# Altium project DUTBoard.PrjPcb (part 3 of 5)

## Sheet ZIF_WRP.SchDoc
size B; DocumentNumber: 9; SheetNumber: 9; SheetTotal: 13
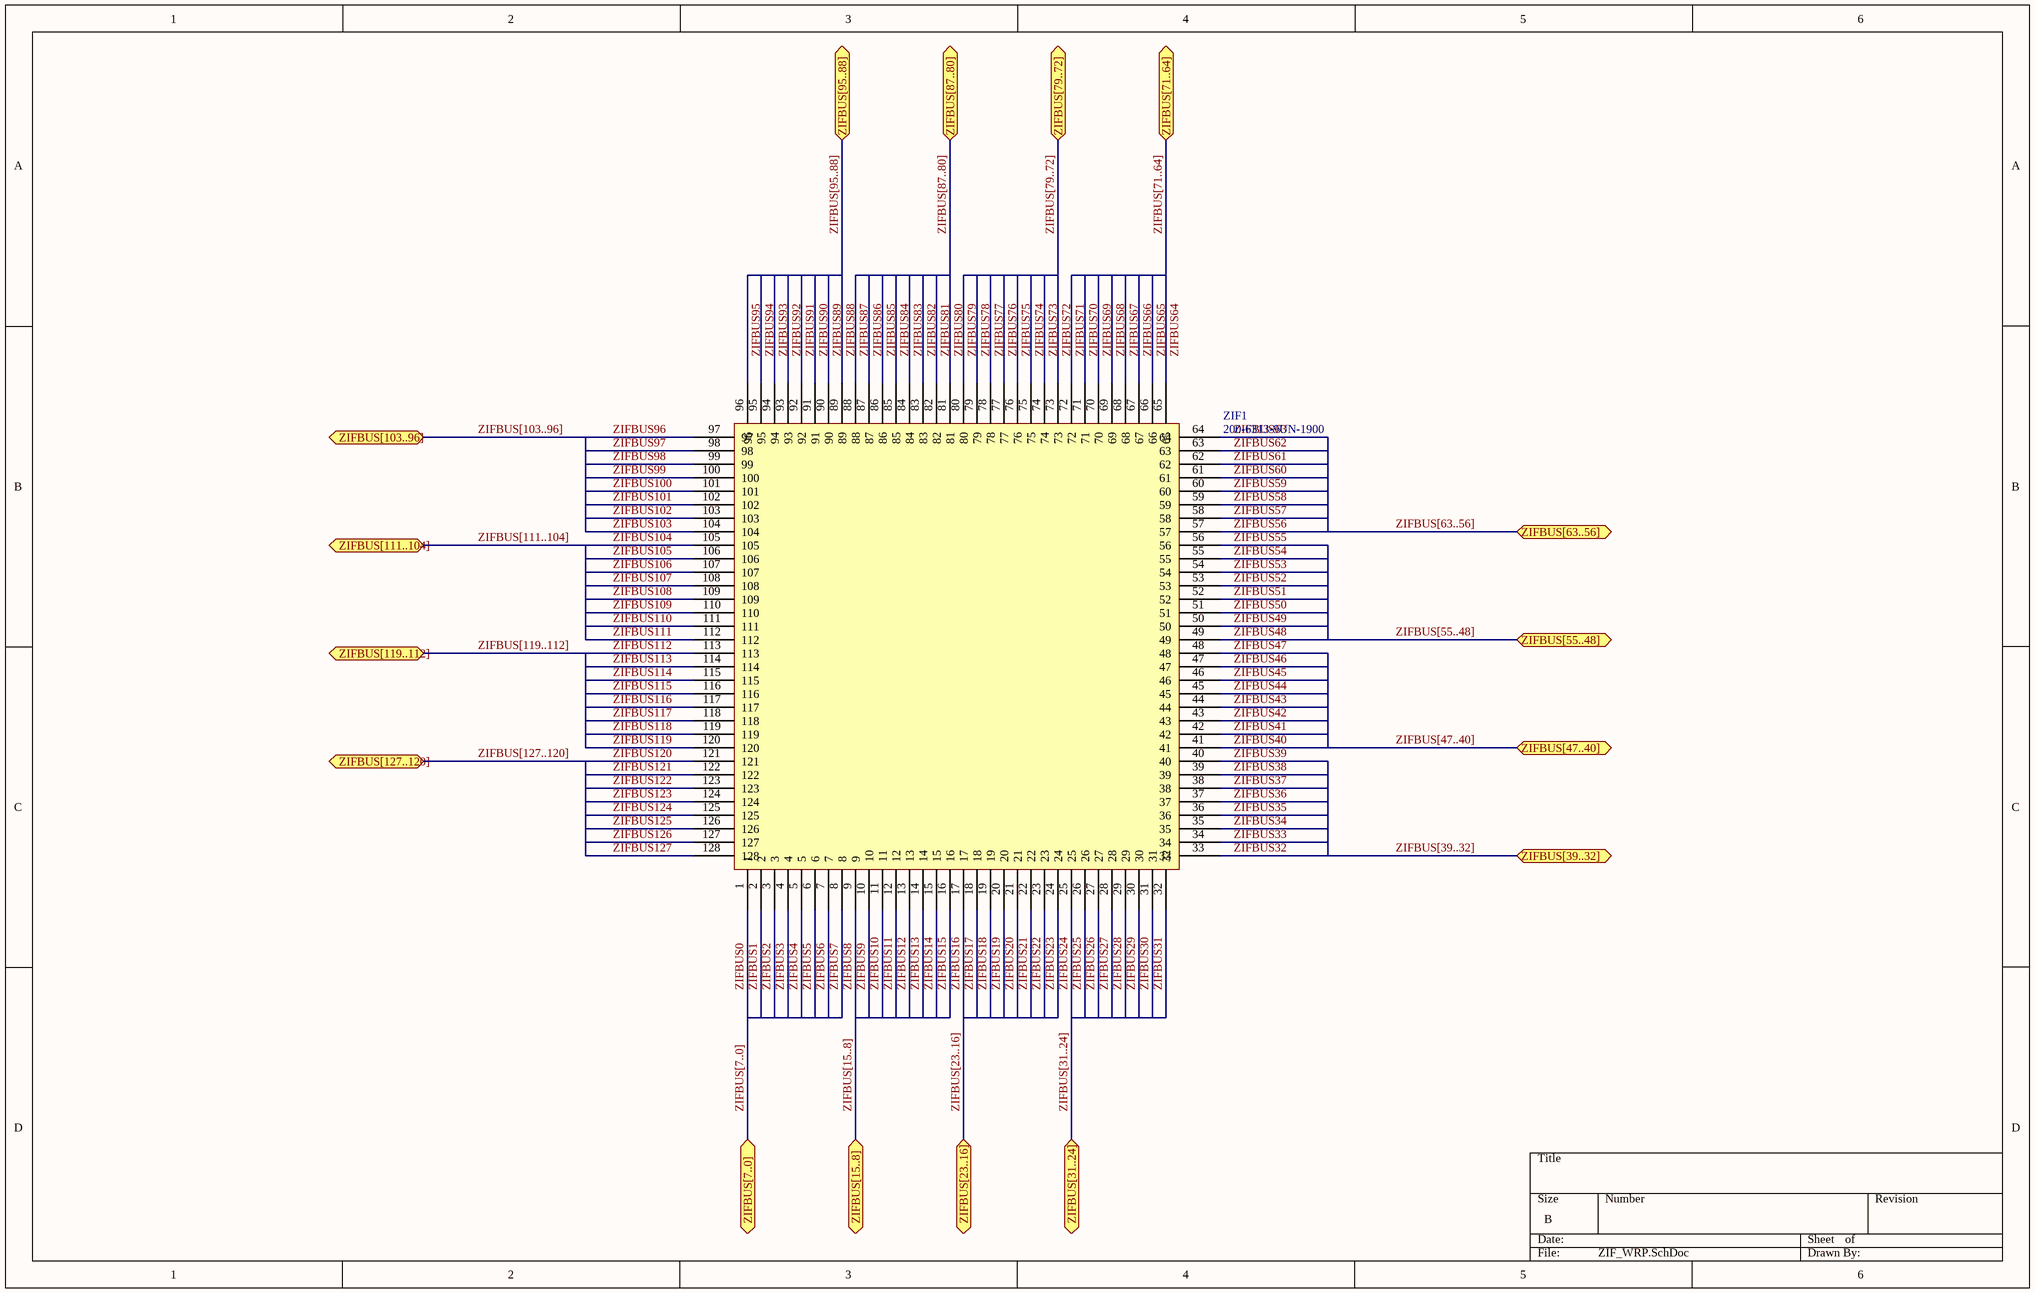
[diagram p9: ZIF_WRP.SchDoc]

### Parts
ZIF1  200-6313-9UN-1900  [ZIF_13x13]

### Ports
ZIFBUS[7..0], ZIFBUS[15..8], ZIFBUS[23..16], ZIFBUS[31..24], ZIFBUS[39..32], ZIFBUS[47..40], ZIFBUS[55..48], ZIFBUS[63..56], ZIFBUS[71..64], ZIFBUS[79..72], ZIFBUS[87..80], ZIFBUS[95..88], ZIFBUS[103..96], ZIFBUS[111..104], ZIFBUS[119..112], ZIFBUS[127..120]

### Nets
ZIFBUS0: ZIF1.1  [project net INSIDE_B0]
ZIFBUS1: ZIF1.2  [project net INSIDE_B1]
ZIFBUS2: ZIF1.3  [project net INSIDE_B2]
ZIFBUS3: ZIF1.4  [project net INSIDE_B3]
ZIFBUS4: ZIF1.5  [project net INSIDE_B4]
ZIFBUS5: ZIF1.6  [project net INSIDE_B5]
ZIFBUS6: ZIF1.7  [project net INSIDE_B6]
ZIFBUS7: ZIF1.8  [project net INSIDE_B7]
ZIFBUS8: ZIF1.9  [project net INSIDE_B8]
ZIFBUS9: ZIF1.10  [project net INSIDE_B9]
ZIFBUS10: ZIF1.11  [project net INSIDE_B10]
ZIFBUS11: ZIF1.12  [project net INSIDE_B11]
ZIFBUS12: ZIF1.13  [project net INSIDE_B12]
ZIFBUS13: ZIF1.14  [project net INSIDE_B13]
ZIFBUS14: ZIF1.15  [project net INSIDE_B14]
ZIFBUS15: ZIF1.16  [project net INSIDE_B15]
ZIFBUS16: ZIF1.17  [project net INSIDE16]
ZIFBUS17: ZIF1.18  [project net INSIDE17]
ZIFBUS18: ZIF1.19  [project net INSIDE18]
ZIFBUS19: ZIF1.20  [project net INSIDE19]
ZIFBUS20: ZIF1.21  [project net INSIDE20]
ZIFBUS21: ZIF1.22  [project net INSIDE21]
ZIFBUS22: ZIF1.23  [project net INSIDE22]
ZIFBUS23: ZIF1.24  [project net INSIDE23]
ZIFBUS24: ZIF1.25  [project net INSIDE24]
ZIFBUS25: ZIF1.26  [project net INSIDE25]
ZIFBUS26: ZIF1.27  [project net INSIDE26]
ZIFBUS27: ZIF1.28  [project net INSIDE27]
ZIFBUS28: ZIF1.29  [project net INSIDE28]
ZIFBUS29: ZIF1.30  [project net INSIDE29]
ZIFBUS30: ZIF1.31  [project net INSIDE30]
ZIFBUS31: ZIF1.32  [project net INSIDE31]
ZIFBUS32: ZIF1.33  [project net INSIDE_B32]
ZIFBUS33: ZIF1.34  [project net INSIDE_B33]
ZIFBUS34: ZIF1.35  [project net INSIDE_B34]
ZIFBUS35: ZIF1.36  [project net INSIDE_B35]
ZIFBUS36: ZIF1.37  [project net INSIDE_B36]
ZIFBUS37: ZIF1.38  [project net INSIDE_B37]
ZIFBUS38: ZIF1.39  [project net INSIDE_B38]
ZIFBUS39: ZIF1.40  [project net INSIDE_B39]
ZIFBUS40: ZIF1.41  [project net INSIDE_B40]
ZIFBUS41: ZIF1.42  [project net INSIDE_B41]
ZIFBUS42: ZIF1.43  [project net INSIDE_B42]
ZIFBUS43: ZIF1.44  [project net INSIDE_B43]
ZIFBUS44: ZIF1.45  [project net INSIDE_B44]
ZIFBUS45: ZIF1.46  [project net INSIDE_B45]
ZIFBUS46: ZIF1.47  [project net INSIDE_B46]
ZIFBUS47: ZIF1.48  [project net INSIDE_B47]
ZIFBUS48: ZIF1.49  [project net INSIDE16]
ZIFBUS49: ZIF1.50  [project net INSIDE17]
ZIFBUS50: ZIF1.51  [project net INSIDE18]
ZIFBUS51: ZIF1.52  [project net INSIDE19]
ZIFBUS52: ZIF1.53  [project net INSIDE20]
ZIFBUS53: ZIF1.54  [project net INSIDE21]
ZIFBUS54: ZIF1.55  [project net INSIDE22]
ZIFBUS55: ZIF1.56  [project net INSIDE23]
ZIFBUS56: ZIF1.57  [project net INSIDE24]
ZIFBUS57: ZIF1.58  [project net INSIDE25]
ZIFBUS58: ZIF1.59  [project net INSIDE26]
ZIFBUS59: ZIF1.60  [project net INSIDE27]
ZIFBUS60: ZIF1.61  [project net INSIDE28]
ZIFBUS61: ZIF1.62  [project net INSIDE29]
ZIFBUS62: ZIF1.63  [project net INSIDE30]
ZIFBUS63: ZIF1.64  [project net INSIDE31]
ZIFBUS64: ZIF1.65  [project net INSIDE_B64]
ZIFBUS65: ZIF1.66  [project net INSIDE_B65]
ZIFBUS66: ZIF1.67  [project net INSIDE_B66]
ZIFBUS67: ZIF1.68  [project net INSIDE_B67]
ZIFBUS68: ZIF1.69  [project net INSIDE_B68]
ZIFBUS69: ZIF1.70  [project net INSIDE_B69]
ZIFBUS70: ZIF1.71  [project net INSIDE_B70]
ZIFBUS71: ZIF1.72  [project net INSIDE_B71]
ZIFBUS72: ZIF1.73  [project net INSIDE_B72]
ZIFBUS73: ZIF1.74  [project net INSIDE_B73]
ZIFBUS74: ZIF1.75  [project net INSIDE_B74]
ZIFBUS75: ZIF1.76  [project net INSIDE_B75]
ZIFBUS76: ZIF1.77  [project net INSIDE_B76]
ZIFBUS77: ZIF1.78  [project net INSIDE_B77]
ZIFBUS78: ZIF1.79  [project net INSIDE_B78]
ZIFBUS79: ZIF1.80  [project net INSIDE_B79]
ZIFBUS80: ZIF1.81  [project net INSIDE16]
ZIFBUS81: ZIF1.82  [project net INSIDE17]
ZIFBUS82: ZIF1.83  [project net INSIDE18]
ZIFBUS83: ZIF1.84  [project net INSIDE19]
ZIFBUS84: ZIF1.85  [project net INSIDE20]
ZIFBUS85: ZIF1.86  [project net INSIDE21]
ZIFBUS86: ZIF1.87  [project net INSIDE22]
ZIFBUS87: ZIF1.88  [project net INSIDE23]
ZIFBUS88: ZIF1.89  [project net INSIDE24]
ZIFBUS89: ZIF1.90  [project net INSIDE25]
ZIFBUS90: ZIF1.91  [project net INSIDE26]
ZIFBUS91: ZIF1.92  [project net INSIDE27]
ZIFBUS92: ZIF1.93  [project net INSIDE28]
ZIFBUS93: ZIF1.94  [project net INSIDE29]
ZIFBUS94: ZIF1.95  [project net INSIDE30]
ZIFBUS95: ZIF1.96  [project net INSIDE31]
ZIFBUS96: ZIF1.97  [project net INSIDE_B96]
ZIFBUS97: ZIF1.98  [project net INSIDE_B97]
ZIFBUS98: ZIF1.99  [project net INSIDE_B98]
ZIFBUS99: ZIF1.100  [project net INSIDE_B99]
ZIFBUS100: ZIF1.101  [project net INSIDE_B100]
ZIFBUS101: ZIF1.102  [project net INSIDE_B101]
ZIFBUS102: ZIF1.103  [project net INSIDE_B102]
ZIFBUS103: ZIF1.104  [project net INSIDE_B103]
ZIFBUS104: ZIF1.105  [project net INSIDE_B104]
ZIFBUS105: ZIF1.106  [project net INSIDE_B105]
ZIFBUS106: ZIF1.107  [project net INSIDE_B106]
ZIFBUS107: ZIF1.108  [project net INSIDE_B107]
ZIFBUS108: ZIF1.109  [project net INSIDE_B108]
ZIFBUS109: ZIF1.110  [project net INSIDE_B109]
ZIFBUS110: ZIF1.111  [project net INSIDE_B110]
ZIFBUS111: ZIF1.112  [project net INSIDE_B111]
ZIFBUS112: ZIF1.113  [project net INSIDE16]
ZIFBUS113: ZIF1.114  [project net INSIDE17]
ZIFBUS114: ZIF1.115  [project net INSIDE18]
ZIFBUS115: ZIF1.116  [project net INSIDE19]
ZIFBUS116: ZIF1.117  [project net INSIDE20]
ZIFBUS117: ZIF1.118  [project net INSIDE21]
ZIFBUS118: ZIF1.119  [project net INSIDE22]
ZIFBUS119: ZIF1.120  [project net INSIDE23]
ZIFBUS120: ZIF1.121  [project net INSIDE24]
ZIFBUS121: ZIF1.122  [project net INSIDE25]
ZIFBUS122: ZIF1.123  [project net INSIDE26]
ZIFBUS123: ZIF1.124  [project net INSIDE27]
ZIFBUS124: ZIF1.125  [project net INSIDE28]
ZIFBUS125: ZIF1.126  [project net INSIDE29]
ZIFBUS126: ZIF1.127  [project net INSIDE30]
ZIFBUS127: ZIF1.128  [project net INSIDE31]

### Buses and harness runs
bus ZIFBUS[7..0] = port ZIFBUS[7..0]
bus ZIFBUS[15..8] = port ZIFBUS[15..8]
bus ZIFBUS[23..16] = port ZIFBUS[23..16]
bus ZIFBUS[31..24] = port ZIFBUS[31..24]
bus ZIFBUS[39..32] = port ZIFBUS[39..32]
bus ZIFBUS[47..40] = port ZIFBUS[47..40]
bus ZIFBUS[55..48] = port ZIFBUS[55..48]
bus ZIFBUS[63..56] = port ZIFBUS[63..56]
bus ZIFBUS[71..64] = port ZIFBUS[71..64]
bus ZIFBUS[79..72] = port ZIFBUS[79..72]
bus ZIFBUS[87..80] = port ZIFBUS[87..80]
bus ZIFBUS[95..88] = port ZIFBUS[95..88]
bus ZIFBUS[103..96] = port ZIFBUS[103..96]
bus ZIFBUS[111..104] = port ZIFBUS[111..104]
bus ZIFBUS[119..112] = port ZIFBUS[119..112]
bus ZIFBUS[127..120] = port ZIFBUS[127..120]

### Library data of the parts
ZIF1 = 200-6313-9UN-1900: CONN SOCKET PGA ZIF 169POS GOLD; Manufacturer: 3M; Number of Positions or Pins (Grid): 169 (13 x 13); Pitch - Mating: 0.100" (2.54mm); Material Flammability Rating: UL94 V-0; Current Rating: 1A; Supplier 1: Digi-Key; Manufacturer Part Number: 200-6313-9UN-1900; RoHS: RoHS Compliant; Category: Connectors, Interconnects; Stock 1: 80; Pricing 1: 1=44.25, 10=41.648, 25=40.3464, 50=37.7436, 100=35.6611, 250=34.61992, 500=33.839 (USD); Packaging: Bulk; Type: PGA, ZIF (ZIP); Contact Finish - Mating: Gold; Contact Finish Thickness - Mating: 30µin (0.76µm); Contact Material - Mating: Beryllium Copper; Mounting Type: Through Hole; Features: -; Termination: Solder; Pitch - Post: 0.100" (2.54mm); Contact Finish - Post: Gold; Contact Finish Thickness - Post: 30µin (0.76µm); Contact Material - Post: Beryllium Copper; Housing Material: Polyethersulfone (PES); Operating Temperature: -55°C ~ 150°C; Termination Post Length: 0.130" (3.30mm); Contact Resistance: -; ComponentLink1URL: http://multimedia.3m.com/mws/mediawebserver?66666UuZjcFSLXTtlX&cMXMXEVuQEcuZgVs6EVs6E666666--; ComponentLink1Description: http://multimedia.3m.com/mws/mediawebserver?66666UuZjcFSLXTtlX&cMXMXEVuQEcuZgVs6EVs6E666666--

## Sheet HEADER_BANK.SchDoc
size B; DocumentNumber: 12; SheetNumber: 12; SheetTotal: 13
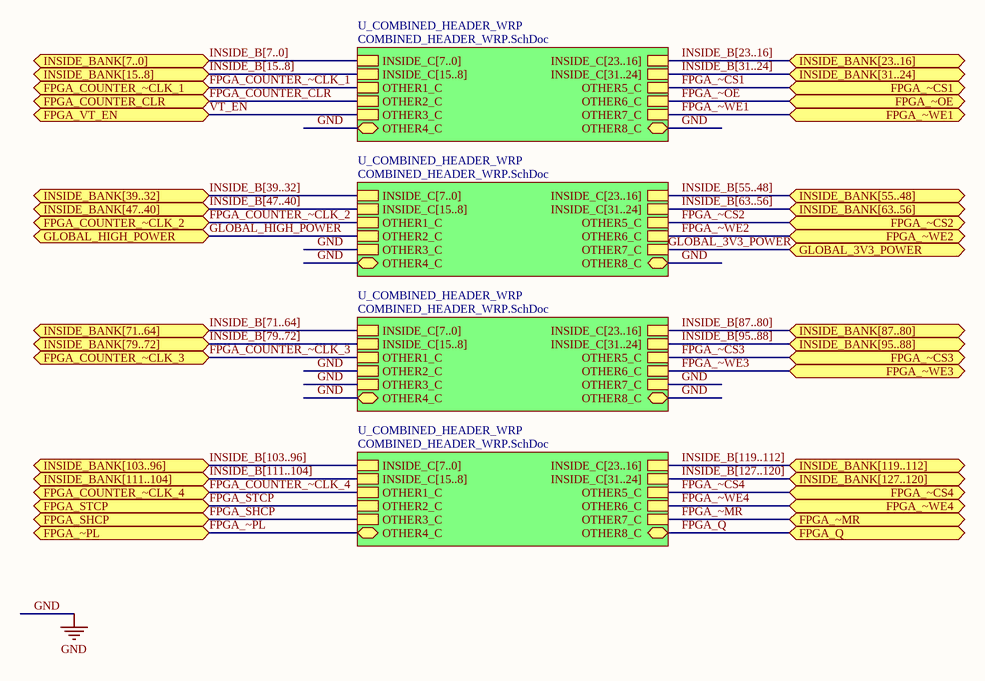
[diagram p10: HEADER_BANK.SchDoc]

### Sub-sheets
U_COMBINED_HEADER_WRP = COMBINED_HEADER_WRP.SchDoc: OTHER1_C, OTHER2_C, OTHER3_C, OTHER5_C, OTHER6_C, OTHER7_C, INSIDE_C[7..0], INSIDE_C[15..8], INSIDE_C[23..16], INSIDE_C[31..24], OTHER4_C, OTHER8_C
U_COMBINED_HEADER_WRP = COMBINED_HEADER_WRP.SchDoc: OTHER1_C, OTHER2_C, OTHER3_C, OTHER5_C, OTHER6_C, OTHER7_C, INSIDE_C[7..0], INSIDE_C[15..8], INSIDE_C[23..16], INSIDE_C[31..24], OTHER4_C, OTHER8_C
U_COMBINED_HEADER_WRP = COMBINED_HEADER_WRP.SchDoc: OTHER1_C, OTHER2_C, OTHER3_C, OTHER5_C, OTHER6_C, OTHER7_C, INSIDE_C[7..0], INSIDE_C[15..8], INSIDE_C[23..16], INSIDE_C[31..24], OTHER4_C, OTHER8_C
U_COMBINED_HEADER_WRP = COMBINED_HEADER_WRP.SchDoc: OTHER1_C, OTHER2_C, OTHER3_C, OTHER5_C, OTHER6_C, OTHER7_C, INSIDE_C[7..0], INSIDE_C[15..8], INSIDE_C[23..16], INSIDE_C[31..24], OTHER4_C, OTHER8_C

### Ports
FPGA_COUNTER_CLR, FPGA_COUNTER_~CLK_1, FPGA_COUNTER_~CLK_2, FPGA_COUNTER_~CLK_3, FPGA_COUNTER_~CLK_4, FPGA_Q, FPGA_SHCP, FPGA_STCP, FPGA_VT_EN, FPGA_~CS1, FPGA_~CS2, FPGA_~CS3, FPGA_~CS4, FPGA_~MR, FPGA_~OE, FPGA_~PL, FPGA_~WE1, FPGA_~WE2, FPGA_~WE3, FPGA_~WE4, GLOBAL_3V3_POWER, GLOBAL_HIGH_POWER, INSIDE_BANK[7..0], INSIDE_BANK[15..8], INSIDE_BANK[23..16], INSIDE_BANK[31..24], INSIDE_BANK[39..32], INSIDE_BANK[47..40], INSIDE_BANK[55..48], INSIDE_BANK[63..56], INSIDE_BANK[71..64], INSIDE_BANK[79..72], INSIDE_BANK[87..80], INSIDE_BANK[95..88], INSIDE_BANK[103..96], INSIDE_BANK[111..104], INSIDE_BANK[119..112], INSIDE_BANK[127..120]

### Nets
GND: sheet U_COMBINED_HEADER_WRP/OTHER4_C, sheet U_COMBINED_HEADER_WRP/OTHER8_C, sheet U_COMBINED_HEADER_WRP/OTHER3_C, sheet U_COMBINED_HEADER_WRP/OTHER4_C, sheet U_COMBINED_HEADER_WRP/OTHER8_C, sheet U_COMBINED_HEADER_WRP/OTHER2_C, sheet U_COMBINED_HEADER_WRP/OTHER3_C, sheet U_COMBINED_HEADER_WRP/OTHER7_C, sheet U_COMBINED_HEADER_WRP/OTHER4_C, sheet U_COMBINED_HEADER_WRP/OTHER8_C
FPGA_COUNTER_CLR: port FPGA_COUNTER_CLR, sheet U_COMBINED_HEADER_WRP/OTHER2_C  [project net CLR_COUNTER_W]
FPGA_COUNTER_~CLK_1: port FPGA_COUNTER_~CLK_1, sheet U_COMBINED_HEADER_WRP/OTHER1_C  [project net CLK_1]
FPGA_COUNTER_~CLK_2: port FPGA_COUNTER_~CLK_2, sheet U_COMBINED_HEADER_WRP/OTHER1_C  [project net CLK_2]
FPGA_COUNTER_~CLK_3: port FPGA_COUNTER_~CLK_3, sheet U_COMBINED_HEADER_WRP/OTHER1_C  [project net CLK_3]
FPGA_COUNTER_~CLK_4: port FPGA_COUNTER_~CLK_4, sheet U_COMBINED_HEADER_WRP/OTHER1_C  [project net CLK_4]
FPGA_Q: port FPGA_Q, sheet U_COMBINED_HEADER_WRP/OTHER8_C
FPGA_SHCP: port FPGA_SHCP, sheet U_COMBINED_HEADER_WRP/OTHER3_C
FPGA_STCP: port FPGA_STCP, sheet U_COMBINED_HEADER_WRP/OTHER2_C
FPGA_~CS1: port FPGA_~CS1, sheet U_COMBINED_HEADER_WRP/OTHER5_C
FPGA_~CS2: port FPGA_~CS2, sheet U_COMBINED_HEADER_WRP/OTHER5_C
FPGA_~CS3: port FPGA_~CS3, sheet U_COMBINED_HEADER_WRP/OTHER5_C
FPGA_~CS4: port FPGA_~CS4, sheet U_COMBINED_HEADER_WRP/OTHER5_C
FPGA_~MR: port FPGA_~MR, sheet U_COMBINED_HEADER_WRP/OTHER7_C
FPGA_~OE: port FPGA_~OE, sheet U_COMBINED_HEADER_WRP/OTHER6_C
FPGA_~PL: port FPGA_~PL, sheet U_COMBINED_HEADER_WRP/OTHER4_C
FPGA_~WE1: port FPGA_~WE1, sheet U_COMBINED_HEADER_WRP/OTHER7_C
FPGA_~WE2: port FPGA_~WE2, sheet U_COMBINED_HEADER_WRP/OTHER6_C
FPGA_~WE3: port FPGA_~WE3, sheet U_COMBINED_HEADER_WRP/OTHER6_C
FPGA_~WE4: port FPGA_~WE4, sheet U_COMBINED_HEADER_WRP/OTHER6_C
GLOBAL_3V3_POWER: port GLOBAL_3V3_POWER, sheet U_COMBINED_HEADER_WRP/OTHER7_C  [project net 3V3]
GLOBAL_HIGH_POWER: port GLOBAL_HIGH_POWER, sheet U_COMBINED_HEADER_WRP/OTHER2_C
VT_EN: port FPGA_VT_EN, sheet U_COMBINED_HEADER_WRP/OTHER3_C  [project net EN]

### Buses and harness runs
bus INSIDE_B[7..0] = port INSIDE_BANK[7..0] = sheet U_COMBINED_HEADER_WRP/INSIDE_C[7..0]
bus INSIDE_B[15..8] = port INSIDE_BANK[15..8] = sheet U_COMBINED_HEADER_WRP/INSIDE_C[15..8]
bus INSIDE_B[23..16] = port INSIDE_BANK[23..16] = sheet U_COMBINED_HEADER_WRP/INSIDE_C[23..16]
bus INSIDE_B[31..24] = port INSIDE_BANK[31..24] = sheet U_COMBINED_HEADER_WRP/INSIDE_C[31..24]
bus INSIDE_B[39..32] = port INSIDE_BANK[39..32] = sheet U_COMBINED_HEADER_WRP/INSIDE_C[7..0]
bus INSIDE_B[47..40] = port INSIDE_BANK[47..40] = sheet U_COMBINED_HEADER_WRP/INSIDE_C[15..8]
bus INSIDE_B[55..48] = port INSIDE_BANK[55..48] = sheet U_COMBINED_HEADER_WRP/INSIDE_C[23..16]
bus INSIDE_B[63..56] = port INSIDE_BANK[63..56] = sheet U_COMBINED_HEADER_WRP/INSIDE_C[31..24]
bus INSIDE_B[71..64] = port INSIDE_BANK[71..64] = sheet U_COMBINED_HEADER_WRP/INSIDE_C[7..0]
bus INSIDE_B[79..72] = port INSIDE_BANK[79..72] = sheet U_COMBINED_HEADER_WRP/INSIDE_C[15..8]
bus INSIDE_B[87..80] = port INSIDE_BANK[87..80] = sheet U_COMBINED_HEADER_WRP/INSIDE_C[23..16]
bus INSIDE_B[95..88] = port INSIDE_BANK[95..88] = sheet U_COMBINED_HEADER_WRP/INSIDE_C[31..24]
bus INSIDE_B[103..96] = port INSIDE_BANK[103..96] = sheet U_COMBINED_HEADER_WRP/INSIDE_C[7..0]
bus INSIDE_B[111..104] = port INSIDE_BANK[111..104] = sheet U_COMBINED_HEADER_WRP/INSIDE_C[15..8]
bus INSIDE_B[119..112] = port INSIDE_BANK[119..112] = sheet U_COMBINED_HEADER_WRP/INSIDE_C[23..16]
bus INSIDE_B[127..120] = port INSIDE_BANK[127..120] = sheet U_COMBINED_HEADER_WRP/INSIDE_C[31..24]

## Sheet COMBINED_HEADER_WRP.SchDoc
size B
Used 4 times, as channels U_HEADER_BANK/U_COMBINED_HEADER_WRP, U_HEADER_BANK/U_COMBINED_HEADER_WRP, U_HEADER_BANK/U_COMBINED_HEADER_WRP, U_HEADER_BANK/U_COMBINED_HEADER_WRP. Parts and nets are listed once, with the designators drawn on the sheet.
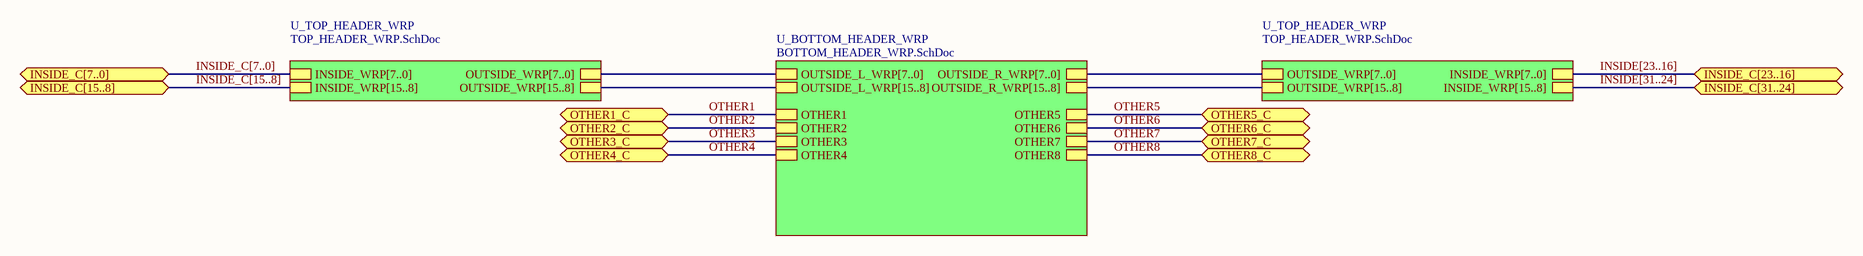
[diagram p11: COMBINED_HEADER_WRP.SchDoc]

### Sub-sheets
U_BOTTOM_HEADER_WRP = BOTTOM_HEADER_WRP.SchDoc: OUTSIDE_L_WRP[7..0], OUTSIDE_R_WRP[7..0], OUTSIDE_L_WRP[15..8], OUTSIDE_R_WRP[15..8], OTHER1, OTHER2, OTHER3, OTHER5, OTHER6, OTHER7, OTHER4, OTHER8
U_TOP_HEADER_WRP = TOP_HEADER_WRP.SchDoc: OUTSIDE_WRP[7..0], INSIDE_WRP[7..0], OUTSIDE_WRP[15..8], INSIDE_WRP[15..8]
U_TOP_HEADER_WRP = TOP_HEADER_WRP.SchDoc: OUTSIDE_WRP[7..0], INSIDE_WRP[7..0], OUTSIDE_WRP[15..8], INSIDE_WRP[15..8]

### Ports
INSIDE_C[7..0], INSIDE_C[15..8], INSIDE_C[23..16], INSIDE_C[31..24], OTHER1_C, OTHER2_C, OTHER3_C, OTHER4_C, OTHER5_C, OTHER6_C, OTHER7_C, OTHER8_C

### Nets
OTHER1: port OTHER1_C, sheet U_BOTTOM_HEADER_WRP/OTHER1
OTHER2: port OTHER2_C, sheet U_BOTTOM_HEADER_WRP/OTHER2
OTHER3: port OTHER3_C, sheet U_BOTTOM_HEADER_WRP/OTHER3
OTHER~{4}: port OTHER4_C, sheet U_BOTTOM_HEADER_WRP/OTHER4
OTHER5: port OTHER5_C, sheet U_BOTTOM_HEADER_WRP/OTHER5
OTHER6: port OTHER6_C, sheet U_BOTTOM_HEADER_WRP/OTHER6
OTHER7: port OTHER7_C, sheet U_BOTTOM_HEADER_WRP/OTHER7
OTHER8: port OTHER8_C, sheet U_BOTTOM_HEADER_WRP/OTHER8

### Channels
U_HEADER_BANK/U_COMBINED_HEADER_WRP: ports OTHER1_C=CLK_1 OTHER2_C=CLR_COUNTER_W OTHER3_C=EN OTHER4_C=GND OTHER5_C=FPGA_~CS1 OTHER6_C=FPGA_~OE OTHER7_C=FPGA_~WE1 OTHER8_C=GND
U_HEADER_BANK/U_COMBINED_HEADER_WRP: ports OTHER1_C=CLK_2 OTHER2_C=GLOBAL_HIGH_POWER OTHER3_C=GND OTHER4_C=GND OTHER5_C=FPGA_~CS2 OTHER6_C=FPGA_~WE2 OTHER7_C=3V3 OTHER8_C=GND
U_HEADER_BANK/U_COMBINED_HEADER_WRP: ports OTHER1_C=CLK_3 OTHER2_C=GND OTHER3_C=GND OTHER4_C=GND OTHER5_C=FPGA_~CS3 OTHER6_C=FPGA_~WE3 OTHER7_C=GND OTHER8_C=GND
U_HEADER_BANK/U_COMBINED_HEADER_WRP: ports OTHER1_C=CLK_4 OTHER2_C=FPGA_STCP OTHER3_C=FPGA_SHCP OTHER4_C=FPGA_~PL OTHER5_C=FPGA_~CS4 OTHER6_C=FPGA_~WE4 OTHER7_C=FPGA_~MR OTHER8_C=FPGA_Q

### Buses and harness runs
bus INSIDE[23..16] = port INSIDE_C[23..16] = sheet U_TOP_HEADER_WRP/INSIDE_WRP[7..0]
bus INSIDE[31..24] = port INSIDE_C[31..24] = sheet U_TOP_HEADER_WRP/INSIDE_WRP[15..8]
bus INSIDE_C[7..0] = port INSIDE_C[7..0] = sheet U_TOP_HEADER_WRP/INSIDE_WRP[7..0]
bus INSIDE_C[15..8] = port INSIDE_C[15..8] = sheet U_TOP_HEADER_WRP/INSIDE_WRP[15..8]
bus sheet U_BOTTOM_HEADER_WRP/OUTSIDE_L_WRP[7..0] = sheet U_TOP_HEADER_WRP/OUTSIDE_WRP[7..0]
bus sheet U_BOTTOM_HEADER_WRP/OUTSIDE_L_WRP[15..8] = sheet U_TOP_HEADER_WRP/OUTSIDE_WRP[15..8]
bus sheet U_BOTTOM_HEADER_WRP/OUTSIDE_R_WRP[7..0] = sheet U_TOP_HEADER_WRP/OUTSIDE_WRP[7..0]
bus sheet U_BOTTOM_HEADER_WRP/OUTSIDE_R_WRP[15..8] = sheet U_TOP_HEADER_WRP/OUTSIDE_WRP[15..8]

## Sheet TOP_HEADER_WRP.SchDoc
size A; DocumentNumber: 11; SheetNumber: 11; SheetTotal: 13
Used 8 times, as channels U_HEADER_BANK/U_COMBINED_HEADER_WRP/U_TOP_HEADER_WRP, U_HEADER_BANK/U_COMBINED_HEADER_WRP/U_TOP_HEADER_WRP, U_HEADER_BANK/U_COMBINED_HEADER_WRP/U_TOP_HEADER_WRP, U_HEADER_BANK/U_COMBINED_HEADER_WRP/U_TOP_HEADER_WRP, U_HEADER_BANK/U_COMBINED_HEADER_WRP/U_TOP_HEADER_WRP, U_HEADER_BANK/U_COMBINED_HEADER_WRP/U_TOP_HEADER_WRP, U_HEADER_BANK/U_COMBINED_HEADER_WRP/U_TOP_HEADER_WRP, U_HEADER_BANK/U_COMBINED_HEADER_WRP/U_TOP_HEADER_WRP. Parts and nets are listed once, with the designators drawn on the sheet.
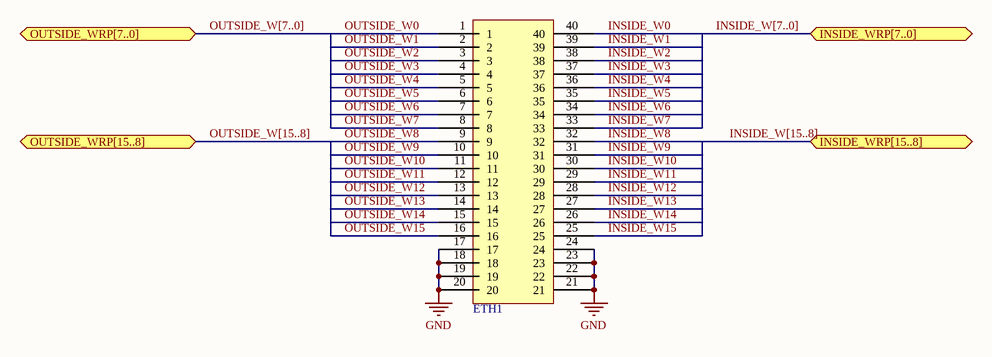
[diagram p12: TOP_HEADER_WRP.SchDoc]

### Parts
ETH1  ADAFRUIT_HEADER  [FEMALE_HEADER_SMD]  (value not drawn)

### Ports
INSIDE_WRP[7..0], INSIDE_WRP[15..8], OUTSIDE_WRP[7..0], OUTSIDE_WRP[15..8]

### Nets
GND: ETH1.17 ETH1.18 ETH1.19 ETH1.20 ETH1.21 ETH1.22 ETH1.23 ETH1.24
INSIDE_W0: ETH1.40
INSIDE_W1: ETH1.39
INSIDE_W2: ETH1.38
INSIDE_W3: ETH1.37
INSIDE_W4: ETH1.36
INSIDE_W5: ETH1.35
INSIDE_W6: ETH1.34
INSIDE_W7: ETH1.33
INSIDE_W8: ETH1.32
INSIDE_W9: ETH1.31
INSIDE_W10: ETH1.30
INSIDE_W11: ETH1.29
INSIDE_W12: ETH1.28
INSIDE_W13: ETH1.27
INSIDE_W14: ETH1.26
INSIDE_W15: ETH1.25
OUTSIDE_W0: ETH1.1
OUTSIDE_W1: ETH1.2
OUTSIDE_W2: ETH1.3
OUTSIDE_W3: ETH1.4
OUTSIDE_W4: ETH1.5
OUTSIDE_W5: ETH1.6
OUTSIDE_W6: ETH1.7
OUTSIDE_W7: ETH1.8
OUTSIDE_W8: ETH1.9
OUTSIDE_W9: ETH1.10
OUTSIDE_W10: ETH1.11
OUTSIDE_W11: ETH1.12
OUTSIDE_W12: ETH1.13
OUTSIDE_W13: ETH1.14
OUTSIDE_W14: ETH1.15
OUTSIDE_W15: ETH1.16

### Channels
U_HEADER_BANK/U_COMBINED_HEADER_WRP/U_TOP_HEADER_WRP: designators ETH1=TH8
U_HEADER_BANK/U_COMBINED_HEADER_WRP/U_TOP_HEADER_WRP: designators ETH1=TH7
U_HEADER_BANK/U_COMBINED_HEADER_WRP/U_TOP_HEADER_WRP: designators ETH1=TH6
U_HEADER_BANK/U_COMBINED_HEADER_WRP/U_TOP_HEADER_WRP: designators ETH1=TH5
U_HEADER_BANK/U_COMBINED_HEADER_WRP/U_TOP_HEADER_WRP: designators ETH1=TH4
U_HEADER_BANK/U_COMBINED_HEADER_WRP/U_TOP_HEADER_WRP: designators ETH1=TH3#1
U_HEADER_BANK/U_COMBINED_HEADER_WRP/U_TOP_HEADER_WRP: designators ETH1=TH2
U_HEADER_BANK/U_COMBINED_HEADER_WRP/U_TOP_HEADER_WRP: designators ETH1=TH3#2

### Buses and harness runs
bus INSIDE_W[7..0] = port INSIDE_WRP[7..0]
bus INSIDE_W[15..8] = port INSIDE_WRP[15..8]
bus OUTSIDE_W[7..0] = port OUTSIDE_WRP[7..0]
bus OUTSIDE_W[15..8] = port OUTSIDE_WRP[15..8]

### Library data of the parts
ETH1 = ADAFRUIT_HEADER: Extra tall female header (SMD)

## Sheet BOTTOM_HEADER_WRP.SchDoc
size A
Used 4 times, as channels U_HEADER_BANK/U_COMBINED_HEADER_WRP/U_BOTTOM_HEADER_WRP, U_HEADER_BANK/U_COMBINED_HEADER_WRP/U_BOTTOM_HEADER_WRP, U_HEADER_BANK/U_COMBINED_HEADER_WRP/U_BOTTOM_HEADER_WRP, U_HEADER_BANK/U_COMBINED_HEADER_WRP/U_BOTTOM_HEADER_WRP. Parts and nets are listed once, with the designators drawn on the sheet.
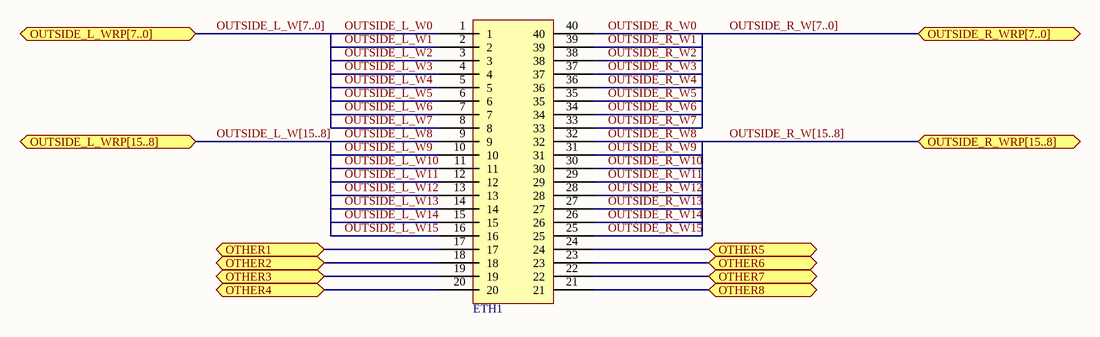
[diagram p13: BOTTOM_HEADER_WRP.SchDoc]

### Parts
ETH1  ADAFRUIT_HEADER  [FEMALE_HEADER_SMD]  (value not drawn)

### Ports
OTHER1, OTHER2, OTHER3, OTHER4, OTHER5, OTHER6, OTHER7, OTHER8, OUTSIDE_L_WRP[7..0], OUTSIDE_L_WRP[15..8], OUTSIDE_R_WRP[7..0], OUTSIDE_R_WRP[15..8]

### Nets
OTHER1: ETH1.17 ; port OTHER1
OTHER2: ETH1.18 ; port OTHER2
OTHER3: ETH1.19 ; port OTHER3
OTHER4: ETH1.20 ; port OTHER4
OTHER5: ETH1.24 ; port OTHER5
OTHER6: ETH1.23 ; port OTHER6
OTHER7: ETH1.22 ; port OTHER7
OTHER8: ETH1.21 ; port OTHER8
OUTSIDE_L_W0: ETH1.1
OUTSIDE_L_W1: ETH1.2
OUTSIDE_L_W2: ETH1.3
OUTSIDE_L_W3: ETH1.4
OUTSIDE_L_W4: ETH1.5
OUTSIDE_L_W5: ETH1.6
OUTSIDE_L_W6: ETH1.7
OUTSIDE_L_W7: ETH1.8
OUTSIDE_L_W8: ETH1.9
OUTSIDE_L_W9: ETH1.10
OUTSIDE_L_W10: ETH1.11
OUTSIDE_L_W11: ETH1.12
OUTSIDE_L_W12: ETH1.13
OUTSIDE_L_W13: ETH1.14
OUTSIDE_L_W14: ETH1.15
OUTSIDE_L_W15: ETH1.16
OUTSIDE_R_W0: ETH1.40
OUTSIDE_R_W1: ETH1.39
OUTSIDE_R_W2: ETH1.38
OUTSIDE_R_W3: ETH1.37
OUTSIDE_R_W4: ETH1.36
OUTSIDE_R_W5: ETH1.35
OUTSIDE_R_W6: ETH1.34
OUTSIDE_R_W7: ETH1.33
OUTSIDE_R_W8: ETH1.32
OUTSIDE_R_W9: ETH1.31
OUTSIDE_R_W10: ETH1.30
OUTSIDE_R_W11: ETH1.29
OUTSIDE_R_W12: ETH1.28
OUTSIDE_R_W13: ETH1.27
OUTSIDE_R_W14: ETH1.26
OUTSIDE_R_W15: ETH1.25

### Channels
U_HEADER_BANK/U_COMBINED_HEADER_WRP/U_BOTTOM_HEADER_WRP: designators end in _U_BOTTOM_HEADER_WRP4; ports OTHER1=CLK_1 OTHER2=CLR_COUNTER_W OTHER3=EN OTHER4=GND OTHER5=FPGA_~CS1 OTHER6=FPGA_~OE OTHER7=FPGA_~WE1 OTHER8=GND
U_HEADER_BANK/U_COMBINED_HEADER_WRP/U_BOTTOM_HEADER_WRP: designators end in _U_BOTTOM_HEADER_WRP3; ports OTHER1=CLK_2 OTHER2=GLOBAL_HIGH_POWER OTHER3=GND OTHER4=GND OTHER5=FPGA_~CS2 OTHER6=FPGA_~WE2 OTHER7=3V3 OTHER8=GND
U_HEADER_BANK/U_COMBINED_HEADER_WRP/U_BOTTOM_HEADER_WRP: designators end in _U_BOTTOM_HEADER_WRP2; ports OTHER1=CLK_3 OTHER2=GND OTHER3=GND OTHER4=GND OTHER5=FPGA_~CS3 OTHER6=FPGA_~WE3 OTHER7=GND OTHER8=GND
U_HEADER_BANK/U_COMBINED_HEADER_WRP/U_BOTTOM_HEADER_WRP: designators end in _U_BOTTOM_HEADER_WRP1; ports OTHER1=CLK_4 OTHER2=FPGA_STCP OTHER3=FPGA_SHCP OTHER4=FPGA_~PL OTHER5=FPGA_~CS4 OTHER6=FPGA_~WE4 OTHER7=FPGA_~MR OTHER8=FPGA_Q

### Buses and harness runs
bus OUTSIDE_L_W[7..0] = port OUTSIDE_L_WRP[7..0]
bus OUTSIDE_L_W[15..8] = port OUTSIDE_L_WRP[15..8]
bus OUTSIDE_R_W[7..0] = port OUTSIDE_R_WRP[7..0]
bus OUTSIDE_R_W[15..8] = port OUTSIDE_R_WRP[15..8]

### Library data of the parts
ETH1 = ADAFRUIT_HEADER: Extra tall female header (SMD)